# Altium schematic sheet FAN_Unit_250316.SchDoc
size A3
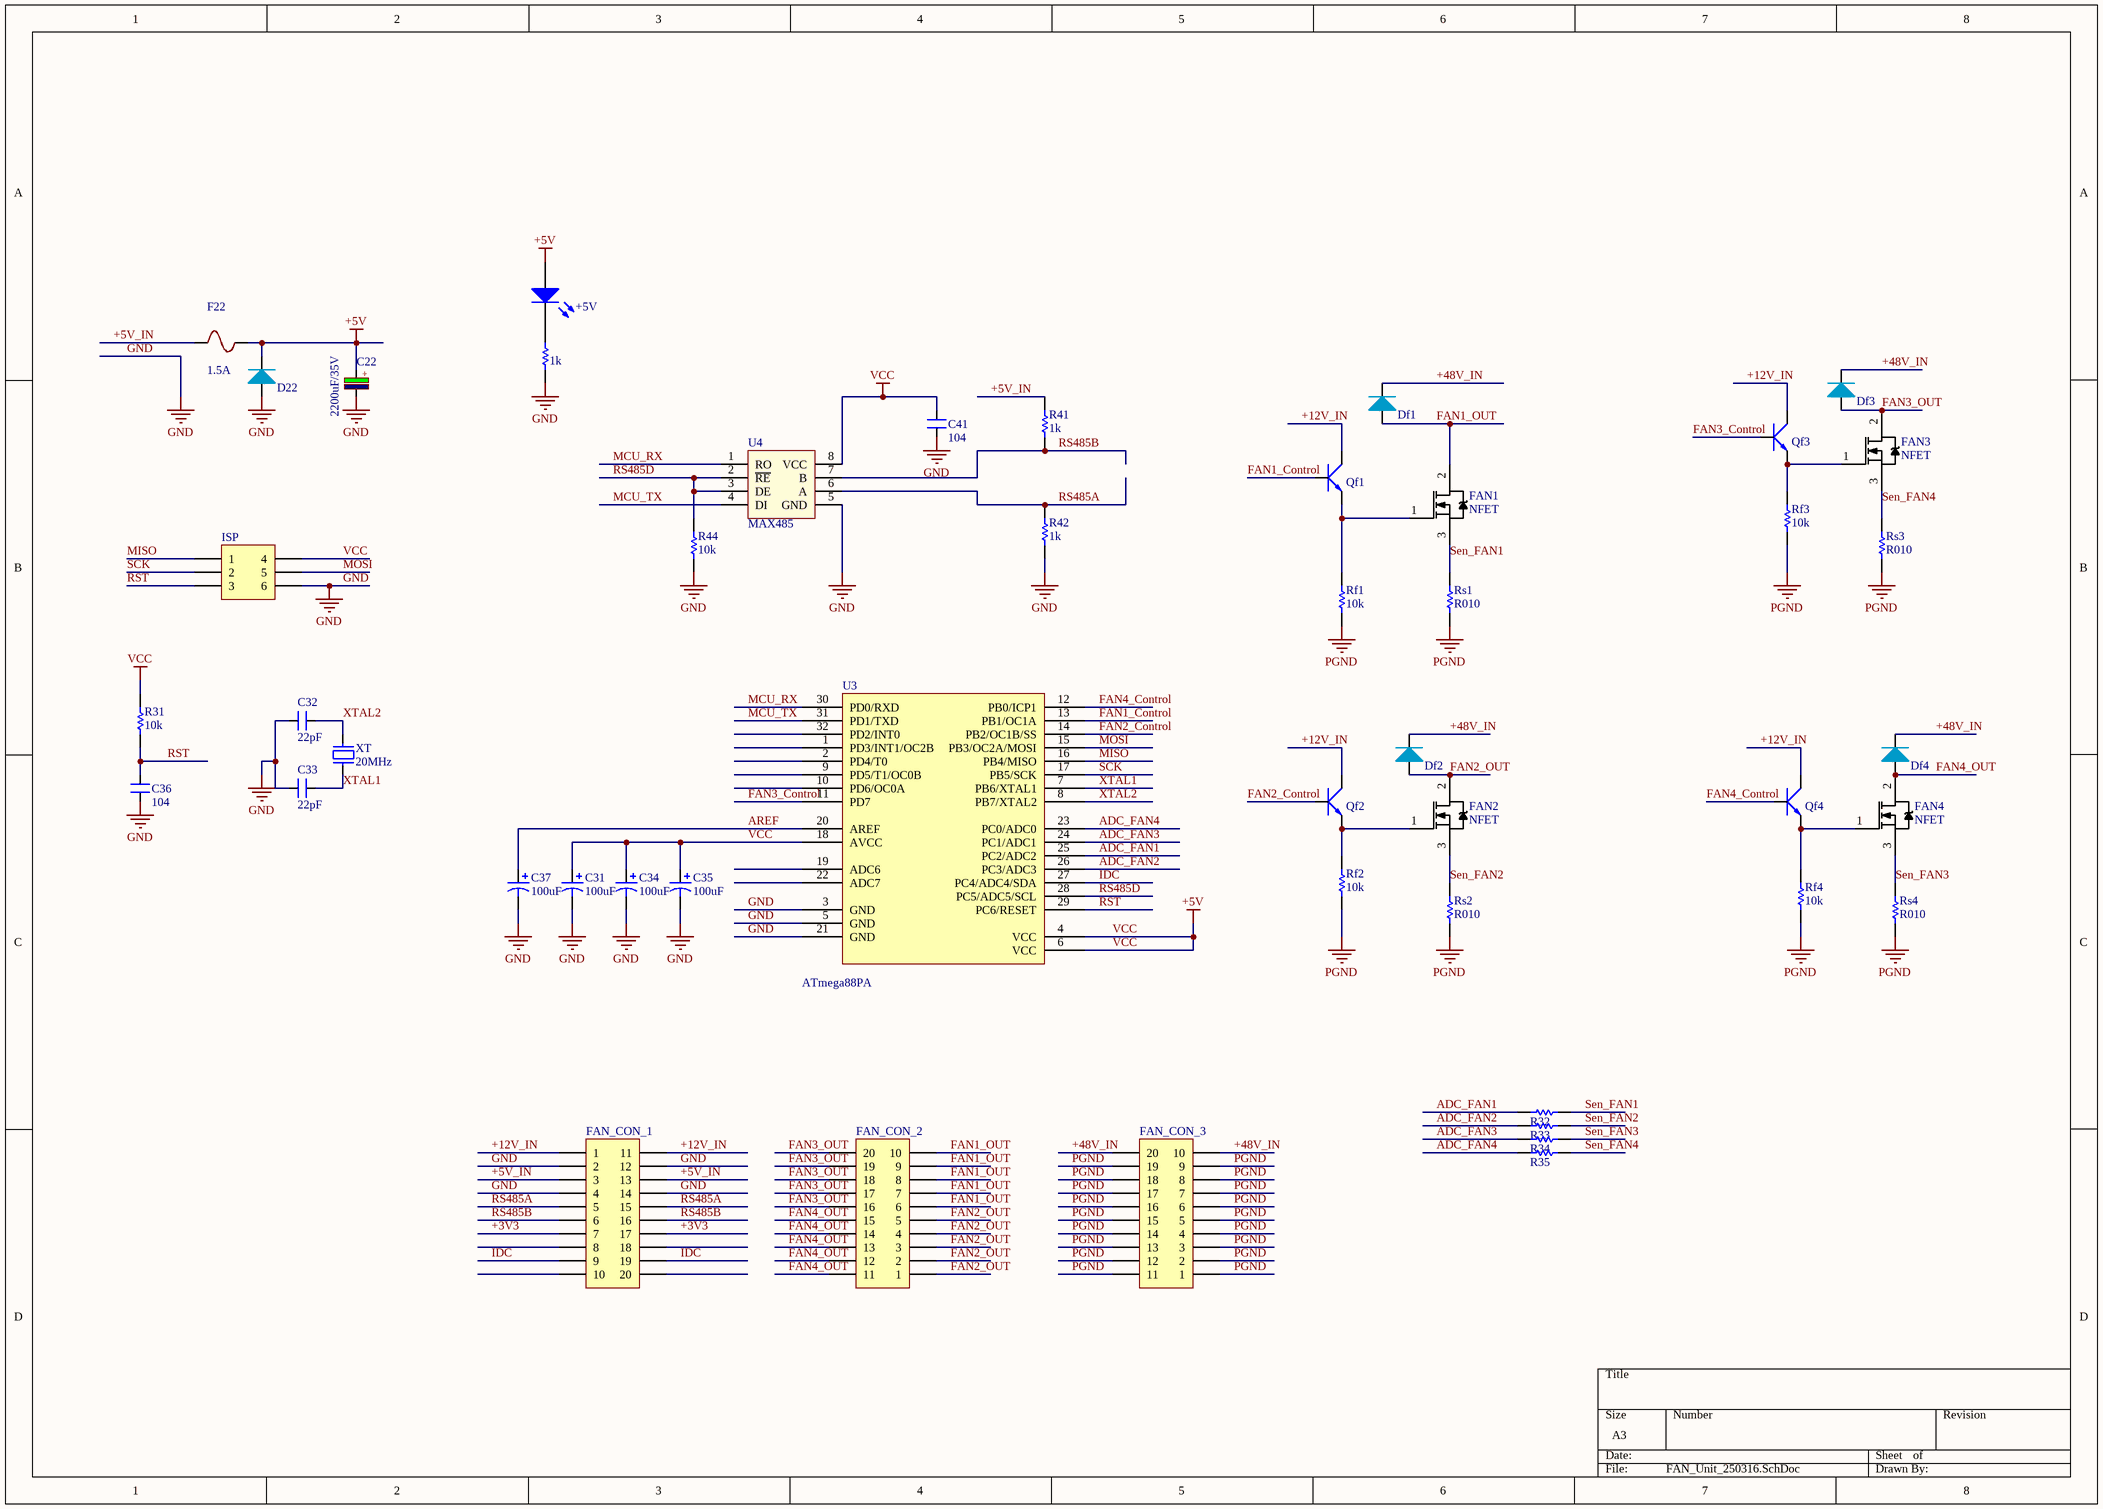
[diagram p0: FAN_Unit_250316.SchDoc]

## Parts
+5V  Led  [LED 5mm RED]  (value not drawn)
C22  2200uF/35V  [CAP_ELEC_SIZE_G]
C31  value 100uF  [CAPC2012N_F]  (hidden comment: Cap)
C32  value 22pF  [CAPC1608N]  (hidden comment: CAP NP)
C33  value 22pF  [CAPC1608N]  (hidden comment: CAP NP)
C34  value 100uF  [CAPC2012N_F]  (hidden comment: Cap)
C35  value 100uF  [CAPC2012N_F]  (hidden comment: Cap)
C36  value 104  [CAPC1608N]  (hidden comment: CAP NP)
C37  value 100uF  [CAPC2012N_F]  (hidden comment: Cap)
C41  value 104  [CAPC2012N_F]  (hidden comment: 100nF/104)
D22  Diode  [DO-214AC]  (value not drawn)
Df1  Diode  [DO-214AC]  (value not drawn)
Df2  Diode  [DO-214AC]  (value not drawn)
Df3  Diode  [DO-214AC]  (value not drawn)
Df4  Diode  [DO-214AC]  (value not drawn)
F22  1.5A  [FUSE_SR-5-BK]
FAN1  NFET  [TO-252]
FAN2  NFET  [TO-252]
FAN3  NFET  [TO-252]
FAN4  NFET  [TO-252]
FAN_CON_1  Header 10X2A  [OMC10]  (value not drawn)
FAN_CON_2  Header 10X2A  [OMC10]  (value not drawn)
FAN_CON_3  Header 10X2A  [OMC10]  (value not drawn)
ISP  Header 3X2A  [HDR2X3_CEN]  (value not drawn)
Qf1  C828  [SOT23 TOP]  (value not drawn)
Qf2  C828  [SOT23 TOP]  (value not drawn)
Qf3  C828  [SOT23 TOP]  (value not drawn)
Qf4  C828  [SOT23 TOP]  (value not drawn)
R22  value 1k  [RESC2012N_F]  (hidden comment: Res_0805_1k)
R31  value 10k  [RESC1608N_ZERO]  (hidden comment: Res)
R32  Res  [RESC1608N_ZERO]  (value not drawn)
R33  Res  [RESC1608N_ZERO]  (value not drawn)
R34  Res  [RESC1608N_ZERO]  (value not drawn)
R35  Res  [RESC1608N_ZERO]  (value not drawn)
R41  1k  [RESC1608N_ZERO]
R42  1k  [RESC1608N_ZERO]
R44  value 10k  [RESC1608N_ZERO]  (hidden comment: 330R)
Rf1  value 10k  [RESC2012N_F]  (hidden comment: Res)
Rf2  value 10k  [RESC2012N_F]  (hidden comment: Res)
Rf3  value 10k  [RESC2012N_F]  (hidden comment: Res)
Rf4  value 10k  [RESC2012N_F]  (hidden comment: Res)
Rs1  value R010  [RESC6332N]  (hidden comment: Res)
Rs2  value R010  [RESC6332N]  (hidden comment: Res)
Rs3  value R010  [RESC6332N]  (hidden comment: Res)
Rs4  value R010  [RESC6332N]  (hidden comment: Res)
U3  ATmega88PA  [32PIN]
U4  MAX485  [SO-8]
XT  20MHz  [XT2]

## Nets
GND: C22.2 C31.2 C32.2 C33.2 C34.2 C35.2 C36.1 C37.2 C41.1 D22.1(A) FAN_CON_1.2 FAN_CON_1.4 FAN_CON_1.12 FAN_CON_1.14 ISP.6 R22.2 R42.1 R44.1 U3.3(GND) U3.5(GND) U3.21(GND) U4.5(GND)
PGND: FAN_CON_3.1 FAN_CON_3.2 FAN_CON_3.3 FAN_CON_3.4 FAN_CON_3.5 FAN_CON_3.6 FAN_CON_3.7 FAN_CON_3.8 FAN_CON_3.9 FAN_CON_3.11 FAN_CON_3.12 FAN_CON_3.13 FAN_CON_3.14 FAN_CON_3.15 FAN_CON_3.16 FAN_CON_3.17 FAN_CON_3.18 FAN_CON_3.19 Rf1.1 Rf2.1 Rf3.1 Rf4.1 Rs1.1 Rs2.1 Rs3.1 Rs4.1
VCC: +5V.1(A) C22.1 C31.1 C34.1 C35.1 C41.2 D22.2(K) F22.2 ISP.4 R31.2 U3.4(VCC) U3.6(VCC) U3.18(AVCC) U4.8(VCC)  [also labelled +5V]
+3V3: FAN_CON_1.7 FAN_CON_1.17
+5V_IN: F22.1 FAN_CON_1.3 FAN_CON_1.13 R41.2
+12V_IN: FAN_CON_1.1 FAN_CON_1.11 Qf1.2(C) Qf2.2(C) Qf3.2(C) Qf4.2(C)
+48V_IN: Df1.2(K) Df2.2(K) Df3.2(K) Df4.2(K) FAN_CON_3.10 FAN_CON_3.20
ADC_FAN1: R32.1 U3.25(PC2/ADC2)
ADC_FAN2: R33.1 U3.26(PC3/ADC3)
ADC_FAN3: R34.1 U3.24(PC1/ADC1)
ADC_FAN4: R35.1 U3.23(PC0/ADC0)
AREF: C37.1 U3.20(AREF)
FAN1_Control: Qf1.1(B) U3.13(PB1/OC1A)
FAN1_OUT: Df1.1(A) FAN1.2(D) FAN_CON_2.6 FAN_CON_2.7 FAN_CON_2.8 FAN_CON_2.9 FAN_CON_2.10
FAN2_Control: Qf2.1(B) U3.14(PB2/OC1B/SS)
FAN2_OUT: Df2.1(A) FAN2.2(D) FAN_CON_2.1 FAN_CON_2.2 FAN_CON_2.3 FAN_CON_2.4 FAN_CON_2.5
FAN3_Control: Qf3.1(B) U3.11(PD7)
FAN3_OUT: Df3.1(A) FAN3.2(D) FAN_CON_2.16 FAN_CON_2.17 FAN_CON_2.18 FAN_CON_2.19 FAN_CON_2.20
FAN4_Control: Qf4.1(B) U3.12(PB0/ICP1)
FAN4_OUT: Df4.1(A) FAN4.2(D) FAN_CON_2.11 FAN_CON_2.12 FAN_CON_2.13 FAN_CON_2.14 FAN_CON_2.15
IDC: FAN_CON_1.9 FAN_CON_1.19 U3.27(PC4/ADC4/SDA)
MCU_RX: U3.30(PD0/RXD) U4.1(RO)
MCU_TX: U3.31(PD1/TXD) U4.4(DI)
MISO: ISP.1 U3.16(PB4/MISO)
MOSI: ISP.5 U3.15(PB3/OC2A/MOSI)
RS485A: FAN_CON_1.5 FAN_CON_1.15 R42.2 U4.6(A)
RS485B: FAN_CON_1.6 FAN_CON_1.16 R41.1 U4.7(B)
RS485D: R44.2 U3.28(PC5/ADC5/SCL) U4.2(~{RE}) U4.3(DE)
RST: C36.2 ISP.3 R31.1 U3.29(PC6/RESET)
SCK: ISP.2 U3.17(PB5/SCK)
Sen_FAN1: FAN1.3(S) R32.2 Rs1.2
Sen_FAN2: FAN2.3(S) R33.2 Rs2.2
Sen_FAN3: FAN4.3(S) R34.2 Rs4.2
Sen_FAN4: FAN3.3(S) R35.2 Rs3.2
XTAL1: C33.1 U3.7(PB6/XTAL1) XT.1
XTAL2: C32.1 U3.8(PB7/XTAL2) XT.2
Net+5V_2: +5V.2(K) R22.1
NetFAN1_1: FAN1.1(G) Qf1.3(E) Rf1.2
NetFAN2_1: FAN2.1(G) Qf2.3(E) Rf2.2
NetFAN3_1: FAN3.1(G) Qf3.3(E) Rf3.2
NetFAN4_1: FAN4.1(G) Qf4.3(E) Rf4.2

Not connected (* = marked no-connect by the designer): FAN_CON_1 8 10 18 20; U3 1(PD3/INT1/OC2B) 2(PD4/T0) 9(PD5/T1/OC0B) 10(PD6/OC0A) 19(ADC6) 22(ADC7) 32(PD2/INT0)

## Notes on the sheet
- (in symbol CP4) +

## Library data of the parts
+5V = Led: pin to pad: 1>A 2>K
C22 = CP4: Cap 1000uF/16V - 220uF/50V; Description 5: 4,7uF>10uF/250V_3,3uF>10uF/400V - 2,2uF>4,7uF/450V; Description 1: 2200uF-3300uF/6,3V - 1000uF-2200uF/10V; Description 2: 1000uF/16V - 470uF => 1000uF/25V - 100uF/100V; Description 3: 330uF>470uF/35V_220uF>470uF/50V_10uF>22uF/250V; Description 4: 220uF => 330uF/63V - 10uF =>33uF/160 - 200V; Value: 1000uF/16V
C41 = CAP NP
D22 Df1-Df4 = Diode: pin to pad: 1>A 2>K
F22 = Fuse
FAN1-FAN4 = NFET: pin to pad: 2>4
FAN_CON_1-FAN_CON_3 = Header 10X2A: Header, 10-Pin, Dual row; LatestRevisionDate: 17-Jul-2002; LatestRevisionNote: Re-released for DXP Platform.; Publisher: Altium Limited
ISP = Header 3X2A: Header, 3-Pin, Dual row; LatestRevisionDate: 17-Jul-2002; LatestRevisionNote: Re-released for DXP Platform.; Publisher: Altium Limited
Qf1-Qf4 = NPN: Transistor C828 C1815....
R22 = Res
R32-R35 = Res: Value: 10k
R41 R42 R44 = Res: Tro dan
  R41 R42: Value: 1k
U3 = ATmega48/168/328
U4 = MAX485: RS232 - RS485 (Same sn75176)
XT = Crystal